# EAGLE design ml-rf (EAGLE 5.00)
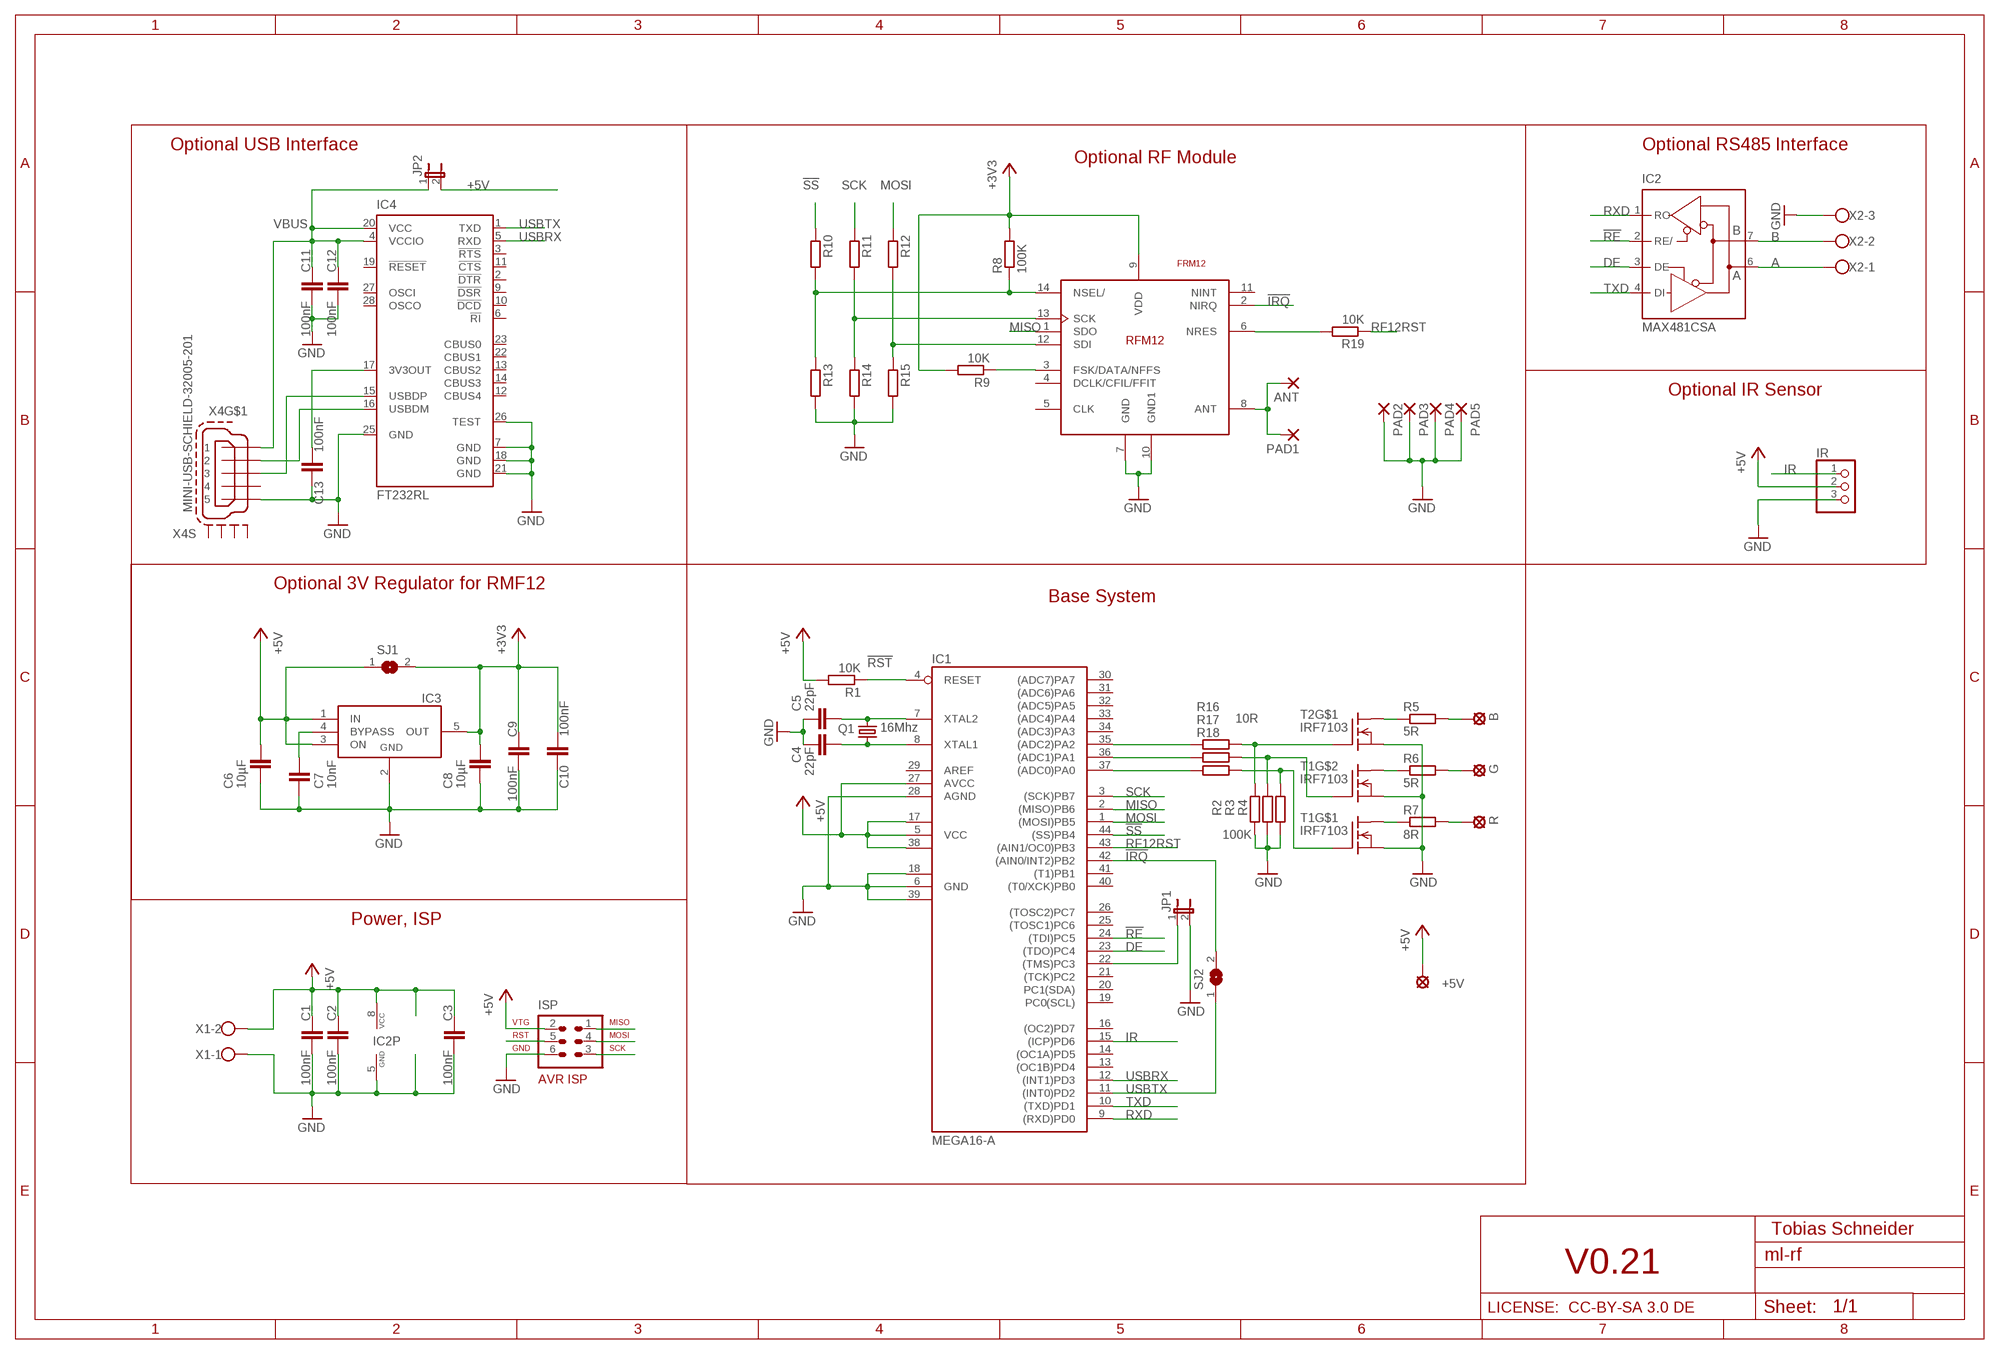
[diagram p0: schematic, sheet 1]

## Parts
+5V  SE14  [SE14]
ANT  2,15/1,0  [2,15/1,0]
B  SE14  [SE14]
C1  100nF  C-EUC0805K  [C0805K]
C2  100nF  C-EUC0805K  [C0805K]
C3  100nF  C-EUC0805K  [C0805K]
C4  22pF  C-EUC0805K  [C0805K]
C5  22pF  C-EUC0805K  [C0805K]
C6  10µF  C-EUC0805K  [C0805K]
C7  10nF  C-EUC0805K  [C0805K]
C8  10µF  C-EUC0805K  [C0805K]
C9  100nF  C-EUC0805K  [C0805K]
C10  100nF  C-EUC0805K  [C0805K]
C11  100nF  C-EUC0805K  [C0805K]
C12  100nF  C-EUC0805K  [C0805K]
C13  100nF  C-EUC0805K  [C0805K]
G  SE14  [SE14]
IC1  MEGA16-A  [TQFP44]
IC2  MAX481CSA  [SO08]
IC3  LP2992-3.3  [SOT-23-5]
IC4  FT232RL  [SSOP28]
IR  PINHD-1X3  [1X03]
ISP  AVR-ISP-6  [AVR-ISP-6]
JP1  JP1E  [JP1]
JP2  JP1E  [JP1]
PAD1  SMD2  [SMD1,27-2,54]
PAD2  SMD2  [SMD1,27-2,54]
PAD3  SMD2  [SMD1,27-2,54]
PAD4  SMD2  [SMD1,27-2,54]
PAD5  SMD2  [SMD1,27-2,54]
Q1  16Mhz  CRYTALHC49UP  [HC49UP]
R  SE14  [SE14]
R1  10K  R-EU_M0805  [M0805]
R2  100K  R-EU_M0805  [M0805]
R3  100K  R-EU_M0805  [M0805]
R4  100K  R-EU_M0805  [M0805]
R5  5R  R-EU_0414/15  [0414/15]
R6  5R  R-EU_0414/15  [0414/15]
R7  8R  R-EU_0414/15  [0414/15]
R8  100K  R-EU_M0805  [M0805]
R9  10K  R-EU_M0805  [M0805]
R10  R-EU_M0805  [M0805]
R11  R-EU_M0805  [M0805]
R12  R-EU_M0805  [M0805]
R13  R-EU_M0805  [M0805]
R14  R-EU_M0805  [M0805]
R15  R-EU_M0805  [M0805]
R16  10R  R-EU_M0805  [M0805]
R17  10R  R-EU_M0805  [M0805]
R18  10R  R-EU_M0805  [M0805]
R19  10K  R-EU_M0805  [M0805]
RFM12  FRM12  [RFM12]
SJ1  SJ  [SJ]
SJ2  SJ  [SJ]
T1  IRF7103  [SO-8]
T2  IRF7103  [SO-8]
X1  W237-102-350  [W237-102-3.5-1.2]
X2  W237-103350  [W237-103-3.5-1.2]
X4  MINI-USB-SCHIELD-32005-201  [32005-201]

## Nets
!IRQ: IC1.42((AIN0/INT2)PB2) RFM12.2(NIRQ) SJ2.2
!RE: IC1.24((TDI)PC5) IC2.2(RE/)
!RST: IC1.4(RESET) ISP.5 R1.1
!SS: IC1.44((SS)PB4) R10.1
+3V3: C8.1 C9.1 C10.2 IC3.5(OUT) R8.2 R9.2 RFM12.9(VDD) SJ1.2
+5V: +5V.MP C1.1 C2.1 C3.1 C6.1 IC1.5(VCC) IC1.17(VCC1) IC1.27(AVCC) IC1.38(VCC2) IC2.8(VCC) IC3.1(IN) IC3.3(ON) IR.2 ISP.2 JP2.2 R1.2 SJ1.1 X1.2
A: IC2.6(A) X2.1
B: IC2.7(B) X2.2
BY: C7.1 IC3.4(BYPASS)
DE: IC1.23((TDO)PC4) IC2.3(DE)
GND: C1.2 C2.2 C3.2 C4.1 C5.1 C6.2 C7.2 C8.2 C9.2 C10.1 C11.2 C12.2 C13.1 IC1.6(GND) IC1.18(GND1) IC1.28(AGND) IC1.39(GND2) IC2.5(GND) IC3.2(GND) IC4.7(GND) IC4.18(GND) IC4.21(GND) IC4.25(GND) IC4.26(TEST) IR.3 ISP.6 JP1.2 PAD2.1(P) PAD3.1(P) PAD4.1(P) PAD5.1(P) R2.2 R3.2 R4.2 R13.2 R14.2 R15.2 RFM12.7(GND) RFM12.10(GND1) T1.1(S) T1.3(S) T2.1(S) X1.1 X2.3 X4.5
IR: IC1.15((ICP)PD6) IR.1
MISO: IC1.2((MISO)PB6) ISP.1 RFM12.1(SDO)
MOSI: IC1.1((MOSI)PB5) ISP.4 R12.1
N$1: R7.1 T1.8(D1)
N$3: R11.2 R14.1 RFM12.13(SCK)
N$4: R6.1 T1.5(D1)
N$5: R5.1 T2.8(D1)
N$6: R12.2 R15.1 RFM12.12(SDI)
N$7: R7.2 R.MP
N$8: G.MP R6.2
N$9: B.MP R5.2
N$10: IC4.16(USBDM) X4.2
N$11: R9.1 RFM12.3(FSK/DATA/NFFS)
N$12: R19.2 RFM12.6(NRES)
N$13: ANT.1(P) PAD1.1(P) RFM12.8(ANT)
N$14: R8.1 R10.2 R13.1 RFM12.14(NSEL/)
N$16: IC4.15(USBDP) X4.3
N$17: IC1.22((TMS)PC3) JP1.1
N$18: IC1.37((ADC0)PA0) R18.2
N$19: IC1.36((ADC1)PA1) R17.2
N$20: C13.2 IC4.17(3V3OUT)
N$21: IC1.35((ADC2)PA2) R16.2
PB: R2.1 R16.1 T2.2(G)
PG: R3.1 R17.1 T1.4(G)
PR: R4.1 R18.1 T1.2(G)
RF12RST: IC1.43((AIN1/OC0)PB3) R19.1
RXD: IC1.9((RXD)PD0) IC2.1(RO)
SCK: IC1.3((SCK)PB7) ISP.3 R11.1
TXD: IC1.10((TXD)PD1) IC2.4(DI)
USBRX: IC1.12((INT1)PD3) IC4.5(RXD)
USBTX: IC1.11((INT0)PD2) IC4.1(TXD) SJ2.1
VBUS: C11.1 C12.1 IC4.4(VCCIO) IC4.20(VCC) JP2.1 X4.1
XTAL1: C5.2 IC1.7(XTAL2) Q1.2
XTAL2: C4.2 IC1.8(XTAL1) Q1.1
Unconnected: IC1.13((OC1B)PD4) IC1.14((OC1A)PD5) IC1.16((OC2)PD7) IC1.19(PC0(SCL)) IC1.20(PC1(SDA)) IC1.21((TCK)PC2) IC1.25((TOSC1)PC6) IC1.26((TOSC2)PC7) IC1.29(AREF) IC1.30((ADC7)PA7) IC1.31((ADC6)PA6) IC1.32((ADC5)PA5) IC1.33((ADC4)PA4) IC1.34((ADC3)PA3) IC1.40((T0/XCK)PB0) IC1.41((T1)PB1) IC4.2(!DTR) IC4.3(!RTS) IC4.6(!RI) IC4.9(!DSR) IC4.10(!DCD) IC4.11(!CTS) IC4.12(CBUS4) IC4.13(CBUS2) IC4.14(CBUS3) IC4.19(!RESET) IC4.22(CBUS1) IC4.23(CBUS0) IC4.27(OSCI) IC4.28(OSCO) RFM12.4(DCLK/CFIL/FFIT) RFM12.5(CLK) RFM12.11(NINT) T1.6(D) T1.7(D) T2.3(S) T2.4(G) T2.5(D1) T2.6(D) T2.7(D) X4.4 X4.M1(S:S1) X4.M2(S:S2) X4.M3(S:S3) X4.M4(S:S4)

## Notes on the sheet
- Optional USB Interface | Optional RS485 Interface
- Optional RF Module
- Optional IR Sensor
- Optional 3V Regulator for RMF12
- Base System
- Power, ISP
- Tobias Schneider
- V0.21
- LICENSE:  CC-BY-SA 3.0 DE

## Library data of the parts
+5V B G R = solpad:SE14: SOLDER PAD E1553, drill 1,4mm, distributor Buerklin, 07F820
ANT = wirepad:2,15/1,0: THROUGH-HOLE PAD
C1-C13 = rcl:C-EU: CAPACITOR, European symbol
IC1 = atmel:MEGA16: MICROCONTROLLER 16 Kbytes FLASH 1 kbytes SRAM 512 bytes EEPROM USART 8-channel 10 bit ADC Source: avr.lbr
IC2 = maxim:MAX481CSA: RS485 TRANSEIVER
IC3 = regulators:LP2992-*: LP2992-x Micropower 250 mA ultra low-dropout regulator in SOT-23-5 package For use with very low ESR output capacitors
IC4 = ftdichip:FT232R: Source: http://www.ftdichip.com/Documents/DataSheets/DS_FT232R_v104.pdf
IR = pinhead:PINHD-1X3: PIN HEADER
ISP = atmel:AVR-ISP-6: AVR ISP-6 Serial Programming Header
JP1 JP2 = jumper:JP1E: JUMPER
PAD1-PAD5 = wirepad:SMD2: SMD PAD
Q1 = crystal:CRYTAL: CRYSTAL
R1-R4 R8-R19 = rcl:R-EU_: RESISTOR, European symbol
R5-R7 = rclml:R-EU_: RESISTOR, European symbol
RFM12 = RFM12:FRM12
SJ1 SJ2 = jumper:SJ: SMD solder JUMPER
T1 T2 = transistor-fet+irf7201:IRF7103
X1 = clamps:W237-102: WAGO SCREW CLAMP
X2 = clamps:W237-103: WAGO SCREW CLAMP
X4 = con-cypressindustries:MINI-USB-SCHIELD-: MINI USB-B Conector Source: www.cypressindustries.com

## Board
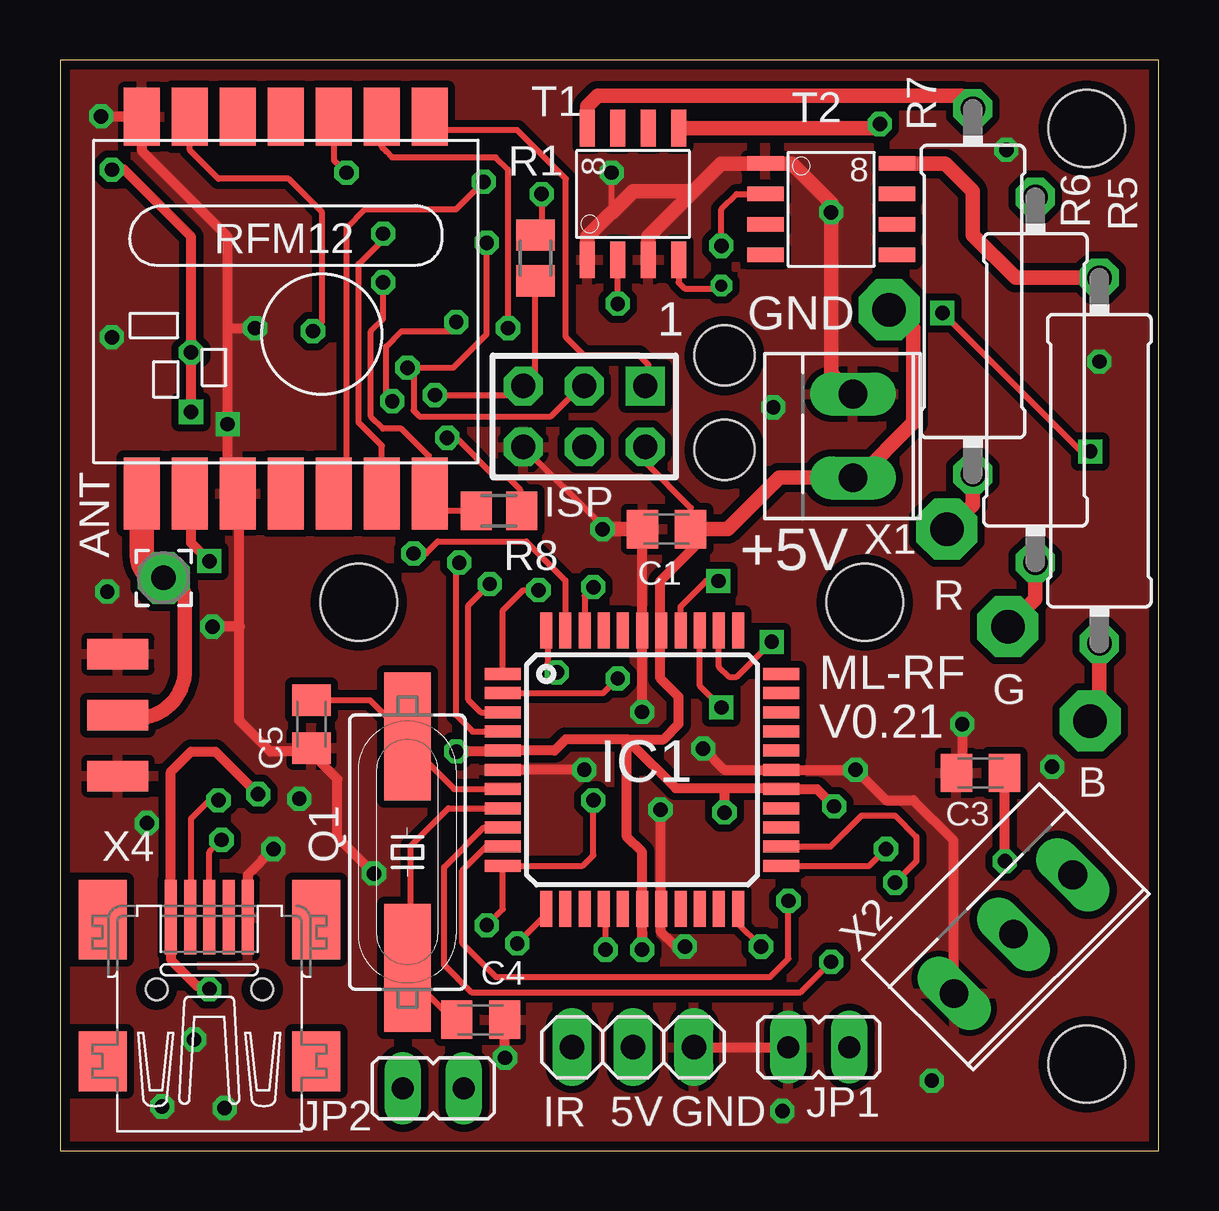
[diagram p1: board, top side]
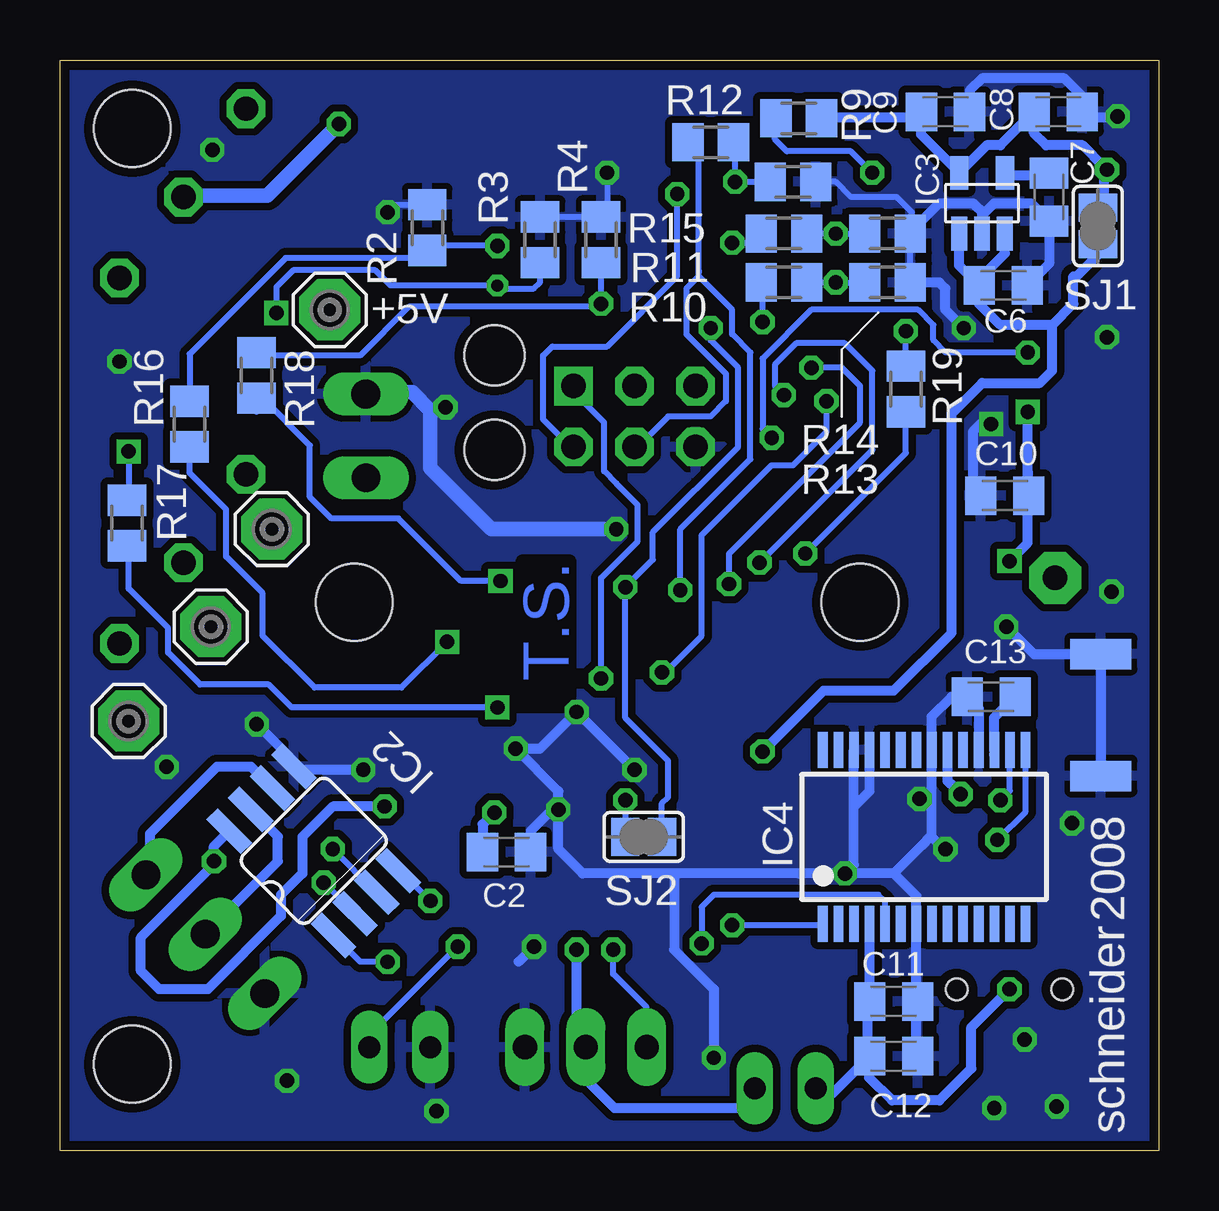
[diagram p2: board, bottom side, seen from below]

Size 45.78 x 45.47 mm. Coordinates in mm from the lower left corner, seen from the top.
Outline: 0,0 45.78,0 45.78,45.47 0,45.47 0,0
Copper layers (1*16): Top 0.035mm / dielectric 1.5mm / Bottom 0.035mm
Design rules "default *": minimum track width 0.2mm, minimum drill 0.5mm, track to track 0.2mm, track to pad 0.2mm, pad to pad 0.2mm, via to via 0.2mm, smd to smd 0mil, copper to edge 0.4mm, drill to drill 8mil, minimum pad ring 0.3mm, minimum via ring 8mil, stop-mask expansion 4mil, vias tented up to drill 0mil, thermal gap 10mil
Holes 3.2 mm at 12.45,22.86 33.53,22.86 42.78,42.61 42.78,3.61
Holes 2.5 mm at 27.69,33.15 27.69,29.21

### Footprints (pad centres in the part's own frame; a part is rotated, then mirrored left to right if it is on the bottom)
SE14 = drill 1.397 pad 2.54 octagon: MP 0,0
2,15/1,0 = drill 1.016 pad 2.159 octagon: 1 0,0
C0805K = smd 1.3 x 1.6: 1 -1,0; 2 1,0
TQFP44 = smd 1.5 x 0.5: 1 -5.8,4; 2 -5.8,3.2; 3 -5.8,2.4; 4 -5.8,1.6; 5 -5.8,0.8; 6 -5.8,0; 7 -5.8,-0.8; 8 -5.8,-1.6; 9 -5.8,-2.4; 10 -5.8,-3.2; 11 -5.8,-4; 23 5.8,-4; 24 5.8,-3.2; 25 5.8,-2.4; 26 5.8,-1.6; 27 5.8,-0.8; 28 5.8,0; 29 5.8,0.8; 30 5.8,1.6; 31 5.8,2.4; 32 5.8,3.2; 33 5.8,4 | smd 0.5 x 1.5: 12 -4,-5.8; 13 -3.2,-5.8; 14 -2.4,-5.8; 15 -1.6,-5.8; 16 -0.8,-5.8; 17 0,-5.8; 18 0.8,-5.8; 19 1.6,-5.8; 20 2.4,-5.8; 21 3.2,-5.8; 22 4,-5.8; 34 4,5.8; 35 3.2,5.8; 36 2.4,5.8; 37 1.6,5.8; 38 0.8,5.8; 39 0,5.8; 40 -0.8,5.8; 41 -1.6,5.8; 42 -2.4,5.8; 43 -3.2,5.8; 44 -4,5.8
SO08 = smd 0.66 x 2.032: 1 -1.905,-3.073; 2 -0.635,-3.073; 3 0.635,-3.073; 4 1.905,-3.073; 5 1.905,3.073; 6 0.635,3.073; 7 -0.635,3.073; 8 -1.905,3.073
SOT-23-5 = smd 0.662 x 1.397: 1 -0.953,-1.27; 2 0,-1.27; 3 0.953,-1.27 | smd 0.762 x 1.397: 4 0.953,1.27; 5 -0.953,1.27
SSOP28 = smd 0.4 x 1.5: 1 -4.225,-3.625; 2 -3.575,-3.625; 3 -2.925,-3.625; 4 -2.275,-3.625; 5 -1.625,-3.625; 6 -0.975,-3.625; 7 -0.325,-3.625; 8 0.325,-3.625; 9 0.975,-3.625; 10 1.625,-3.625; 11 2.275,-3.625; 12 2.925,-3.625; 13 3.575,-3.625; 14 4.225,-3.625; 15 4.225,3.625; 16 3.575,3.625; 17 2.925,3.625; 18 2.275,3.625; 19 1.625,3.625; 20 0.975,3.625; 21 0.325,3.625; 22 -0.325,3.625; 23 -0.975,3.625; 24 -1.625,3.625; 25 -2.275,3.625; 26 -2.925,3.625; 27 -3.575,3.625; 28 -4.225,3.625
1X03 = drill 1.016 long: 1 -2.54,0; 2 0,0; 3 2.54,0
AVR-ISP-6 = drill 1.016 square: 1 -2.54,-1.27 | drill 1.016 octagon: 2 -2.54,1.27; 3 0,-1.27; 4 0,1.27; 5 2.54,-1.27; 6 2.54,1.27
JP1 = drill 0.914 long: 1 0,-1.27; 2 0,1.27
SMD1,27-2,54 = smd 1.27 x 2.54: 1 0,0
HC49UP@1 = smd 5.334 x 1.93: 1 -4.826,0; 2 4.826,0
M0805 = smd 1.3 x 1.6: 1 -0.95,0; 2 0.95,0
0414/15 = drill 1.016 octagon: 1 -7.62,0; 2 7.62,0
RFM12 = smd 1.5 x 2.4: 1 -5,-9.7; 2 -3,-9.7; 3 -1,-9.7; 4 1,-9.7; 5 3,-9.7; 6 5,-9.7; 7 7,-9.7 | smd 1.5 x 3: 8 7,6; 9 5,6; 10 3,6; 11 1,6; 12 -1,6; 13 -3,6; 14 -5,6
SJ = smd 1.168 x 1.6: 1 -0.762,0; 2 0.762,0
SO-8 = smd 1.524 x 0.61: 1 -2.743,1.27; 2 -2.743,0; 3 -2.743,-1.27; 4 -2.743,-2.54; 5 2.743,-2.54; 6 2.743,-1.27; 7 2.743,0; 8 2.743,1.27
W237-102-3.5-1.2 = drill 1.2 long: 1 -1.7,0 | drill 1.194 long: 2 1.8,0
W237-103-3.5-1.2 = drill 1.2 long: 1 -3.5,0 | drill 1.194 long: 2 0,0; 3 3.5,0
32005-201 = smd 3.1 x 0.5: 1 3,1.6; 2 3,0.8; 3 3,0; 4 3,-0.8; 5 3,-1.6 | smd 2.5 x 2: M1 -3,-4.45; M2 -3,4.45 | smd 3.3 x 2: M3 2.9,4.45; M4 2.9,-4.45 | hole 0.9: 0,2.2; 0,-2.2

### Placement (x,y rotation side)
+5V  34.54,35.05 0 bottom
ANT  4.32,23.88 0 top
B  42.93,17.91 0 bottom
C1  25.27,25.91 180 top
C2  27.18,12.45 0 bottom
C3  38.35,15.75 180 top
C4  17.53,5.46 180 top
C5  10.48,17.78 90 top
C6  6.48,36.07 0 bottom
C7  4.57,39.75 270 bottom
C8  4.19,43.31 0 bottom
C9  8.89,43.31 0 bottom
C10  6.41,27.3 0 bottom
C11  11.05,6.22 0 bottom
C12  11.05,3.94 0 bottom
C13  6.99,18.92 0 bottom
G  39.5,21.84 0 bottom
IC1  24.26,15.88 0 top
IC2  35.21,12.5 45 bottom
IC3  7.37,39.5 0 bottom
IC4  9.78,13.08 0 bottom
IR  23.88,4.32 0 top
ISP  21.84,30.61 180 top
JP1  31.62,4.32 90 top
JP2  15.56,2.6 270 top
PAD1  2.41,18.16 90 top
PAD2  2.41,20.7 90 top
PAD3  2.41,15.62 90 top
PAD4  2.41,15.62 270 bottom
PAD5  2.41,20.7 90 bottom
Q1  16Mhz  [HC49UP@1]  14.48,12.45 90 top
R  36.96,25.91 0 bottom
R1  19.81,37.21 90 top
R2  30.48,38.48 90 bottom
R3  25.78,37.97 90 bottom
R4  23.24,37.97 90 bottom
R5  43.31,28.77 270 top
R6  40.64,32.13 270 top
R7  38.04,35.81 270 top
R8  18.29,26.67 0 top
R9  15,43.04 0 bottom
R10  15.62,36.2 0 bottom
R11  15.62,38.23 0 bottom
R12  18.67,42.04 0 bottom
R13  11.3,36.2 0 bottom
R14  11.3,38.23 0 bottom
R15  15.24,40.39 0 bottom
R16  40.39,30.29 270 bottom
R17  42.99,26.16 270 bottom
R18  37.59,32.32 270 bottom
R19  10.54,31.75 90 bottom
RFM12  10.41,33.4 180 top
SJ1  2.54,38.54 90 bottom
SJ2  21.46,13.08 0 bottom
T1  23.24,39.88 90 top
T2  32.13,39.88 0 top
X1  33.04,29.84 270 top
X2  39.73,9.03 225 top
X4  6.22,6.73 90 top

### Tracks (layer width: path | path; a pad name or v marks a point on that pad's centre or on a via)
!IRQ  (via drill 0.6)
  Top 0.254: 13.59,41.66 13.84,41.4 18.16,41.4 18.67,40.89 v18.67,34.29 | 13.59,41.66 13.46,41.78 | RFM12.2 13.41,41.83 13.59,41.66 | IC1.42 21.86,23.13 v22.23,23.5
  Bottom 0.254: v18.67,34.29 18.67,33.78 17.53,32.64 17.53,29.34 21.08,25.78 21.08,24.64 v22.23,23.5 22.23,18.03 20.45,16.26 20.45,14.73 20.7,14.48 SJ2.2
!RE  (via drill 0.6)
  Top 0.254: IC1.24 32.11,12.68 33.4,13.97 34.8,13.97 35.69,13.08 35.69,12.06 v34.8,11.18
  Bottom 0.254: IC2.2 33.52,9.91 33.66,9.91 33.66,10.03 v34.8,11.18
!RST  (via drill 0.6)
  Top 0.254: 19.05,31.62 ISP.5 19.43,31.88 | v15.62,31.5 19.05,31.5 19.43,31.88 | 19.69,36.32 19.75,36.32 R1.1 | 19.69,36.07 19.81,36.2 R1.1 | IC1.4 17.2,17.48 16.51,18.16 16.51,24.51 v16.64,24.51 | R1.1 19.81,36.32 | 19.43,31.88 19.81,32.26 R1.1
  Bottom 0.254: v15.62,31.5 16,31.88 16,32.77 15.11,33.66 13.08,33.66 11.94,32.51 11.94,29.21 v16.64,24.51
!SS  (via drill 0.6)
  Top 0.254: 20.32,21.59 20.26,21.65 IC1.44 20.32,21.61 20.32,21.59 | v16.51,34.54 16.26,34.29 16.26,34.16 14.22,34.16 13.59,33.53 13.59,31.5 v13.84,31.24 | 20.32,21.59 20.32,20.32 v20.7,19.94
  Bottom 0.254: R10.1 16.51,36.2 v16.51,34.54 | v13.84,31.24 13.84,29.97 15.24,28.57 16.13,28.57 19.05,25.65 19.05,21.46 20.57,19.94 v20.7,19.94
+3V3  (via drill 0.6)
  Top 0.254: v16.13,29.72 16.51,29.72 18.16,28.07 18.67,28.07 19.18,27.56 19.18,26.67 R8.2
  Top 0.305: RFM12.9 5.46,27.45
  Top 0.406: v2.16,40.89 2.67,40.89 5.46,38.1 v5.46,33.27 v5.46,30.8 | RFM12.9 5.45,27.37 5.46,27.37 5.46,25.34 v6.22,24.57
  Bottom 0.254: v16.13,29.72 16.51,30.1 16.51,33.02 14.48,35.05 10.03,35.05 9.4,34.42 9.4,33.78 8.89,33.27 v5.46,33.27
  Bottom 0.406: 14.07,43.05 14.22,43.05 | 14.07,43.05 R9.2 | 14.07,43.05 10.14,43.05 C9.1 9.91,43.31 9.91,42.35 IC3.5 7.18,41.91 6.6,41.91 5.33,43.18 5.08,43.18 5.08,43.2 C8.1 5.19,43.07 5.21,43.05 5.21,42.42 4.7,41.91 3.17,41.91 2.29,41.02 2.29,40.77 | v2.16,40.89 2.29,40.77 | 5.46,28.32 5.46,25.34 v6.22,24.57 | 5.46,28.32 v5.46,30.8 | C10.2 5.46,27.35 5.46,28.32 | SJ1.2 2.54,39.37 2.29,39.62 2.29,40.77
+5V  (via drill 0.6)
  Top 0.254: ISP.2 24.38,28.7 26.29,26.8 26.29,25.91 | R1.2 19.81,38.23 20.07,38.48 v20.07,39.88
  Top 0.406: 23.62,17.14 21.08,17.14 20.61,16.68 IC1.5 18.42,16.64 v16.51,16.64 | 23.62,17.14 25.15,17.14 25.78,17.78 25.78,18.92 25.02,19.68 25.02,21.72 | 23.62,17.02 23.62,13.08 24.26,12.45 IC1.17 24.26,9.14 | 23.62,17.02 23.62,17.14 | 23.62,17.02 23.75,17.02 25.65,15.11 27.69,15.11 | 25.02,21.72 IC1.38 | 25.02,21.72 25.02,23.75 26.42,25.15 26.42,25.78 26.29,25.91 | 27.69,15.11 30.02,15.11 IC1.27 31.53,15.07 v32.26,14.35 | 27.69,15.11 v27.69,14.1 | C3.1 39.37,15.73 v39.37,12.06 | 24.26,9.14 24.26,8.89 | v24.26,8.38 24.26,9.14
  Top 0.61: C1.1 26.29,25.91 27.81,25.91 29.97,28.07 33.02,28.07 X1.2 33.25,28.05 35.56,30.35 35.56,34.29 34.8,35.05 +5V.MP
  Bottom 0.254: ISP.2 24.51,29.34 25.65,30.48 25.65,33.15 25.27,33.53 22.99,33.53 20.07,36.45 v20.07,39.88
  Bottom 0.406: C2.1 28.18,13.61 v27.69,14.1 | IC3.1 8.32,36.89 7.62,36.2 | 7.49,36.07 7.62,36.2 | IC3.3 6.41,37.4 7.62,36.2 | 4.44,34.42 3.56,35.31 3.56,36.45 3.43,36.45 2.54,37.34 SJ1.1 | 4.44,34.42 6.6,34.42 7.49,35.31 7.49,36.07 | 7.49,36.07 C6.1 | IC2.8 39.37,12.69 39.37,12.19 | v32.26,14.35 34.42,14.35 35.69,13.08 35.69,11.56 36.58,10.67 36.58,9.78 39.62,6.73 41.66,6.73 42.42,7.49 42.42,8.89 39.37,11.94 39.37,12.19 | 39.37,12.19 v39.37,12.06 | v16.51,16.64 13.97,19.18 11.05,19.18 8.64,21.59 8.64,30.73 7.37,32 4.95,32 4.44,32.51 4.44,34.42 | v24.26,8.38 24.26,4.76 23.81,4.32 IR.2 23.81,4.25 23.88,4.19 23.88,2.98 22.67,1.78 17.46,1.78 JP2.2
A
  Bottom 0.406: IC2.6 37.82,16 39.24,16 42.04,13.21 42.04,11.43 42.13,11.43 X2.1
B
  Bottom 0.406: IC2.7 36.7,13.09 36.7,12.06 39.75,9.02 39.75,9 | 39.75,9 39.75,8.89 | X2.2 39.75,9
BY
  Bottom 0.406: C7.1 4.57,40.64 6.29,40.64 IC3.4
DE  (via drill 0.6)
  Top 0.254: IC1.23 33.72,11.88 v34.42,12.57
  Bottom 0.254: IC2.3 32.62,10.77 v34.42,12.57
GND  (via drill 0.6)
  Top 0.254: 24.51,37.21 T1.3 24.64,37.01 | 25.02,10.16 25.02,10.11 IC1.18 25.02,10.03 | 21.97,37.21 21.84,37.34 | 32.15,38.99 32.13,38.99 v32.13,39.12 | 21.97,38.1 22.99,39.12 v22.99,40.77 | ISP.6 22.61,26.04 v22.61,25.91
  Top 0.406: v21.84,15.88 IC1.6 | 25.02,10.07 25.02,10.03 25.02,9.91 | 25.02,10.07 IC1.18 25.06,10.12 25.02,10.16 | v25.02,14.22 25.02,10.16 | 25.02,10.16 25.02,10.07 | 30.1,15.88 IC1.28 29.97,15.88 | v24.26,18.29 IC1.39 24.26,25.91 | 29.97,15.88 27.69,15.88 v26.8,16.76 | 7.37,27.56 7.49,27.43 7.46,27.4 | 7.46,27.4 RFM12.10 7.41,27.51 7.37,27.56 | 7.37,27.56 6.98,27.94 v6.98,30.29 6.98,34.29 | v1.71,43.12 1.73,43.1 RFM12.7 3.35,43.1 3.3,43.05 3.3,43.31 3.43,43.18 3.43,41.66 6.98,38.1 6.98,34.29 | 6.98,34.29 v8.13,34.29 | 29.97,15.88 v33.15,15.88 34.42,14.61 35.56,14.61 37.21,12.95 37.21,6.51 | 37.21,6.51 37.21,6.35 | 37.21,6.51 X2.3 | C3.2 37.59,15.99 v37.59,17.78 | v26.03,8.51 25.65,8.51 25.02,9.14 25.02,10.16 | 26.67,4.32 JP1.2 | 7.46,21.84 7.46,27.4 | v13.08,11.56 11.56,13.08 11.56,15.49 10.41,16.64 | 7.46,21.84 7.49,21.84 | 7.46,21.84 v6.35,21.84 | X4.5 7.82,11.51 v8.89,12.57 | C4.1 18.53,3.89 v18.54,3.87 | 7.46,21.84 7.46,17.94 8.76,16.64 10.41,16.64 | C5.1 10.48,16.76 10.54,16.7 10.48,16.64 10.41,16.64
  Top 0.61: 32.15,38.99 32.15,39.48 30.48,41.15 29.72,41.15 | 29.34,41.15 T2.1 29.72,41.15 | 29.72,41.15 27.56,41.15 26.42,40.01 | 26.42,40.01 24.51,38.1 24.51,37.21 | T1.1 21.97,37.21 21.97,38.1 23.88,40.01 26.42,40.01 | X1.1 33.04,31.51 33.02,31.5 32.13,32.38 32.13,38.99 | C1.2 24.26,25.91 v22.61,25.91
  Bottom 0.254: R3.2 23.43,38.92 23.37,38.86 23.31,38.92 R4.2 23.18,38.86 22.99,38.86 v22.99,40.77 | R2.2 31.82,39.43 v32.13,39.12 | R15.2 13.46,40.39 12.83,39.75 10.92,39.75 10.29,39.12 10.29,38.35 10.41,38.23 | 10.41,38.23 10.54,38.1 | 10.41,38.23 R14.2 10.35,36.26 10.41,36.2 R13.2 | 12.07,16.76 12.05,16.75 IC4.25
  Bottom 0.406: v25.02,14.22 25.02,14.99 v26.8,16.76 25.78,16.76 v24.26,18.29 v21.84,15.88 | v25.02,14.22 25.27,14.22 26.16,13.34 C2.2 | 7.3,39.05 6.86,39.5 5.32,39.5 C7.2 4.57,36.97 C6.2 | 7.3,39.05 7.37,38.99 7.37,38.35 7.24,38.23 IC3.2 | C9.2 7.89,43.32 8,43.43 7.87,43.56 7.87,44.2 7.37,44.7 3.94,44.7 3.19,43.96 C8.2 3.17,43.29 3.17,43.05 1.78,43.05 v1.71,43.12 | 10.29,38.35 9.14,39.5 7.75,39.5 7.3,39.05 | R13.2 9.14,36.2 8.89,35.94 8.89,35.05 v8.13,34.29 | v25.02,14.22 25.02,12.57 24,11.56 20.26,11.56 | 14.99,11.56 14.86,11.56 | 14.99,11.56 20.26,11.56 | v33.15,15.88 35.89,15.88 IC2.5 36.15,16.13 36.2,16.13 36.2,16.38 v37.59,17.78 | v26.03,8.51 26.67,7.87 | 7.49,16.7 7.49,16.38 | 7.49,16.7 IC4.18 | 7.49,16.7 7.49,18.43 C13.1 8.64,18.92 9.46,18.1 9.46,16.57 | v13.08,11.56 14.99,11.56 | 2.41,15.49 PAD4.1 PAD5.1 5.21,20.7 v6.35,21.84 | 11.05,11.56 10.1,10.61 IC4.7 10.1,6.29 10.03,6.22 C11.2 10.1,6.18 10.1,3.94 C12.2 | 11.05,11.56 v13.08,11.56 | 11.05,11.56 9.91,12.7 | 9.91,12.7 9.51,13.09 | v13.08,11.56 13.21,11.43 | 12.7,14.35 12.7,11.93 v13.08,11.56 | 12.7,14.35 IC4.26 | 12.7,14.35 12.05,15 12.05,16.75 | 9.46,16.57 9.46,13.14 9.49,13.11 | 9.91,12.7 9.49,13.11 | 9.49,13.11 | v8.89,12.57 8.95,12.57 9.49,13.11 | v18.54,3.87 18.54,6.73 20.19,8.38 20.19,11.49 20.26,11.56 | 9.46,16.57 9.46,16.7 IC4.21 | C10.1 7.75,27.64 7.75,29.97 7.43,30.29 v6.98,30.29
  Bottom 0.61: v22.61,25.91 27.81,25.91 30.35,28.45 30.35,30.86 31.12,31.62 33.02,31.62 33.04,31.61 X1.1
  other vias: 5.59,4.64 36.32,2.92 41.34,16 29.72,30.99 2.16,33.91 1.97,23.3 3.62,13.65 39.43,41.72 43.31,32.89 9.97,14.67 30.1,1.65 4.25,1.84 6.86,1.78
  pour Bottom (isolate 0.305): -0.89,46.29 46.35,46.04 46.48,-0.51 -0.83,-0.32
  pour Top (isolate 0.305): -0.83,46.35 46.42,45.91 46.48,-0.38 -0.83,-0.38
IR  (via drill 0.6)
  Top 0.254: IC1.15 22.66,10.08 22.73,10.16 v22.73,8.38
  Bottom 0.254: v22.73,8.38 22.73,7.37 21.34,5.97 21.34,4.19 | IR.1 21.34,4.19 | 21.34,4.19 21.4,4.13
MISO  (via drill 0.6)
  Top 0.254: ISP.1 24.38,31.75 24.51,31.88 24.51,32.77 24.13,33.15 21.84,33.15 21.08,33.91 21.08,40.51 19.05,42.55 15.37,42.55 15.37,43.05 RFM12.1 | IC1.2 22.63,19.07 v23.24,19.68
  Top 0.406: 18.42,19.05 18.43,19.05 IC1.2
  Top 0.61: RFM12.1 15.37,43.05 15.37,43.56
  Bottom 0.254: ISP.1 24.38,31.62 23.11,30.35 23.11,28.32 22.61,27.81 | 22.61,27.81 22.35,27.56 | 22.61,27.81 21.72,26.92 21.72,25.4 23.24,23.88 v23.24,19.68
MOSI  (via drill 0.6)
  Top 0.254: 18.42,19.81 18.42,19.83 IC1.1 18.46,22.52 19.3,23.37 v19.94,23.37
  Bottom 0.254: ISP.4 21.72,29.34 20.45,30.61 18.67,30.61 18.03,31.24 18.03,32.38 19.69,34.04 19.69,35.94 19.18,36.45 | R12.1 19.56,42.04 19.18,41.66 19.18,36.7 | 19.18,36.7 19.18,36.58 | 19.18,36.45 17.78,35.05 17.78,34.04 17.02,33.27 17.02,28.83 19.94,25.91 v19.94,23.37 | 19.18,36.45 19.18,36.7
N$1
  Top 0.61: T1.8 21.97,43.54 22.41,43.98 37.55,43.98 38.1,43.43 R7.1
N$3  (via drill 0.6)
  Top 0.254: RFM12.13 13.41,29.39 12.45,30.35 12.45,36.96 13.46,37.97 v13.46,38.23
  Bottom 0.254: R14.1 v13.46,38.23 R11.2
N$4  (via drill 0.6)
  Top 0.61: T1.5 33.99,42.62 v34.16,42.8
  Bottom 0.61: R6.1 40.64,39.81 37.15,39.81 v34.16,42.8
N$5
  Top 0.61: T2.8 36.89,41.15 38.04,40.01 38.04,38.16 39.81,36.39 43.24,36.39 43.31,36.45 R5.1
N$6  (via drill 0.6)
  Top 0.254: v17.65,40.39 16.51,39.24 12.7,39.24 11.94,38.48 11.94,27.94 11.41,27.42 RFM12.12
  Bottom 0.254: R12.2 17.65,42.04 v17.65,40.39 R15.1
N$7
  Top 0.61: 37.08,25.91 R.MP 37.02,25.91 38.04,26.92 R7.2
N$8
  Top 0.61: R6.2 40.64,22.99 G.MP
N$9
  Top 0.61: B.MP 42.93,17.97 43.31,18.35 R5.2
N$10  (via drill 0.6)
  Top 0.254: X4.2 5.42,9.99 5.46,10.03 5.46,13.84 6.22,14.61 v6.6,14.61
  Bottom 0.254: IC4.16 6.2,15.01 v6.6,14.61
N$11  (via drill 0.6)
  Top 0.254: 11.56,41.15 v11.94,40.77 | 11.56,41.15 11.43,41.27 | RFM12.3 11.41,41.29 11.56,41.15
  Bottom 0.254: v11.94,40.77 12.83,41.66 15.49,41.66 16,42.16 16,43.05 15.99,43.04 R9.1
N$12  (via drill 0.6)
  Top 0.254: RFM12.6 5.41,41.7 6.6,40.51 9.52,40.51 10.92,39.12 10.92,34.54 v10.54,34.16
  Bottom 0.254: 10.54,32.64 R19.2 v10.54,34.16
N$13
  Top 0.61: PAD1.1 arc111 5.21,20.07 5.21,22.99 arc90 ANT.1
  Top 1.016: RFM12.8 3.41,24.78 arc90 ANT.1
N$14  (via drill 0.6)
  Top 0.254: 15.49,26.67 15.49,27.43 15.45,27.43 RFM12.14 15.41,28.19 | 15.49,26.67 15.49,26.61 | 15.41,28.19 15.41,28.27 | v13.46,36.2 13.46,34.67 12.95,34.16 12.95,30.61 13.46,30.1 14.22,30.1 15.37,28.96 15.37,28.19 15.41,28.19 | 15.49,26.67 15.37,26.67 | R8.1 15.49,26.67
  Bottom 0.254: R13.1 v13.46,36.2 R10.2 14.73,36.2
N$16  (via drill 0.6)
  Top 0.254: 6.22,9.65 X4.3 6.22,12.45 v6.73,12.95
  Bottom 0.254: IC4.15 5.55,14.13 v6.73,12.95
N$17  (via drill 0.6)
  Top 0.254: IC1.22 28.21,10.03 28.19,10.03 28.19,9.53 v29.21,8.51
  Bottom 0.254: JP1.1 32.89,4.83 v29.21,8.51
N$18  (via drill 0.6)
  Top 0.254: IC1.37 25.86,22.68 26.92,23.75 v27.43,23.75
  Bottom 0.254: R18.2 37.59,31.5 | R18.2 37.59,30.8 | R18.2 37.34,31.37 35.37,29.4 35.37,27.24 34.48,26.35 31.69,26.35 29.08,23.75 v27.43,23.75
N$19  (via drill 0.6)
  Top 0.254: IC1.36 26.66,19.38 v27.56,18.48
  Bottom 0.254: v27.56,18.48 36.13,18.48 37.08,19.43 39.94,19.43 41.28,20.77 41.28,21.78 42.93,23.43 42.93,25.21 R17.2
N$20
  Bottom 0.406: IC4.17 6.86,16.51 | IC4.17 | C13.2 6.86,18.05 IC4.17
N$21  (via drill 0.6)
  Top 0.254: IC1.35 27.46,20.17 27.88,19.75 28.19,19.75 v29.65,21.21
  Bottom 0.254: v29.65,21.21 31.56,19.3 35.18,19.3 37.34,21.46 37.34,23.24 38.86,24.77 38.86,26.73 40.39,28.26 R16.2 40.39,29.65
PB  (via drill 0.6)
  Top 0.254: T2.2 29.34,39.88 | v27.56,37.72 27.56,39.24 28.19,39.88 T2.2 | T2.2 29.46,39.88
  Bottom 0.254: R2.1 30.48,37.47 | R2.1 30.29,37.72 v27.56,37.72 | R2.1 30.48,37.21 36.39,37.21 40.39,33.21 R16.1
PG  (via drill 0.5, 0.6)
  Top 0.254: T1.4 25.78,36.2 26.03,35.94 27.43,35.94 v27.56,36.07 | v36.77,34.92 42.54,29.15 v42.93,29.15
  Bottom 0.254: v27.56,36.07 27.43,36.07 | v27.56,36.07 32,36.07 32.64,36.7 36.07,36.7 36.77,36.01 v36.77,34.92 | R3.1 25.78,36.2 26.03,35.94 27.43,35.94 v27.56,36.07 | 42.93,27.05 42.93,26.73 | 42.93,27.05 R17.1 | v42.93,29.15 42.93,27.05
PR  (via drill 0.6)
  Top 0.254: v23.24,35.31 T1.2
  Bottom 0.254: 23.24,37.08 R4.1 v23.24,35.31 23.24,35.18 31.24,35.18 33.27,33.15 37.53,33.15 37.59,33.21 R18.1
RF12RST  (via drill 0.6)
  Top 0.254: v14.73,24.89 15.24,24.89 15.75,25.4 19.43,25.4 21.06,23.77 21.06,22.06 21.08,22.04 21.06,22.01 IC1.43
  Bottom 0.254: 10.54,30.86 R19.1 10.54,29.08 v14.73,24.89
RXD  (via drill 0.6)
  Top 0.254: IC1.9 17.67,13.47 16,11.81 16,7.75 17.14,6.6 30.86,6.6 v32.13,7.87
  Bottom 0.254: IC2.1 34.42,9.02 | IC2.1 | v32.13,7.87 33.27,7.87 IC2.1
SCK  (via drill 0.6)
  Top 0.254: 18.57,18.16 IC1.3 17.54,18.27 17.02,18.8 17.02,22.73 v17.91,23.62 | ISP.3 21.72,31.88 20.45,30.61 14.99,30.61 14.73,30.86 14.73,32.64 v14.48,32.64 16.38,32.64 17.78,34.04 v17.78,37.85
  Bottom 0.254: R11.1 16.64,38.23 17.02,37.85 v17.78,37.85 | v14.48,32.64 13.21,32.64 12.45,31.88 12.45,30.35 17.91,24.89 v17.91,23.62
TXD  (via drill 0.6)
  Top 0.254: IC1.10 17.76,12.68 16.76,11.68 16.76,8.64 18.16,7.24 29.59,7.24 30.35,8 30.35,10.29 | 30.35,10.29 30.35,10.03 | 30.35,10.29 v30.35,10.41
  Bottom 0.254: 31.69,11.75 32,12.06 | 31.69,11.75 IC2.4 | v30.35,10.41 31.69,11.75
USBRX  (via drill 0.6)
  Top 0.254: 20.19,10.14 20.19,10.29 | 20.19,10.14 IC1.12 | v19.05,8.64 20.19,9.78 20.19,10.14
  Bottom 0.254: IC4.5 11.4,10.39 11.68,10.67 18.54,10.67 19.05,10.16 v19.05,8.64 19.11,8.57
USBTX  (via drill 0.6)
  Top 0.254: v22.23,14.61 22.23,12.32 21.78,11.88 IC1.11 18.46,10.07 v17.78,9.4
  Bottom 0.254: v22.23,14.61 SJ2.1 | IC4.1 14.04,9.46 14.1,9.4 v17.78,9.4
VBUS  (via drill 0.6)
  Top 0.406: v8.25,14.86 6.48,16.64 5.46,16.64 4.62,15.8 X4.1 4.62,9.47 4.64,9.46 4.64,7.94 5.72,6.86 6.1,6.86 v6.22,6.73 6.29,6.67
  Bottom 0.406: v8.25,14.86 8.7,15.3 | 8.7,15.3 8.76,15.37 | IC4.20 8.8,15.41 8.7,15.3 | 12.05,6.17 12.05,6.18 C11.1 | 12.05,6.17 IC4.4 | C12.1 12.11,3.87 12.13,3.87 12.13,6.1 12.05,6.17 | 14.35,2.41 JP2.1 13.57,2.41 C12.1 | v6.22,6.73 7.81,5.14 7.81,3.43 9.14,2.1 11.11,2.1 12.07,3.05 12.07,3.92 C12.1
XTAL1
  Top 0.254: IC1.7 16.42,15.07 14.22,17.27 Q1.2 14.48,17.21 12.91,18.78 C5.2
XTAL2
  Top 0.254: IC1.8 16.18,14.28 14.6,12.7 14.6,7.62 14.48,7.49 Q1.1 14.48,7.37 16.38,5.46 C4.2

### Text on the board
Bottom: T.S.
tPlace: 1 | GND | +5V | ML-RF | V0.21 | 5V | GND
bPlace: 2008 | schneider